# EAGLE design voltaged (EAGLE 9.6.0)
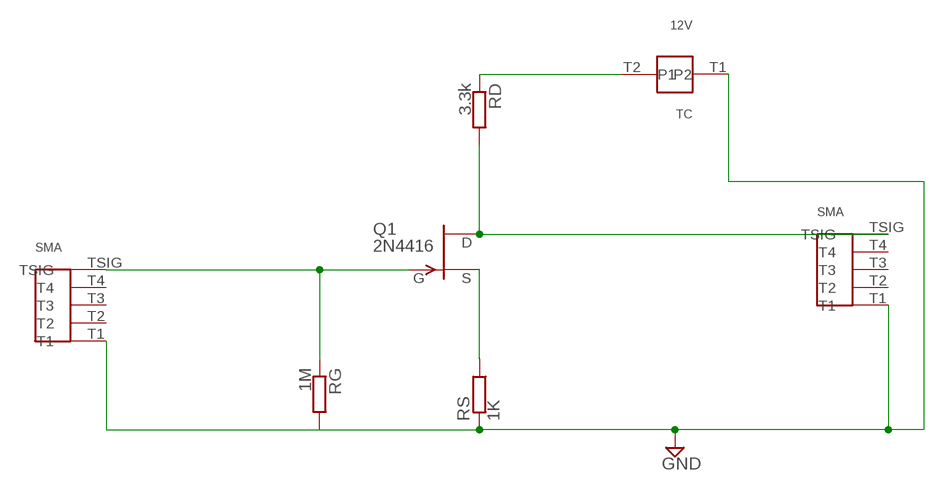
[diagram p0: schematic, sheet 1]

## Parts
Q1  2N4416  [TO72]
RD  3.3k  SMR-0  [SMR-0]
RG  1M  SMR-0  [SMR-0]
RS  1K  SMR-0  [SMR-0]
U$1  TC  [TC]
U$2  TC  [TC]
U$3  TC  [TC]

## Nets
GND: RG.1 RS.2 U$1.T1(P1) U$2.T1 U$3.T1
N$1: Q1.3(G) RG.2 U$2.TSIG
N$4: Q1.1(S) RS.1
N$6: Q1.2(D) RD.1 U$3.TSIG
N$7: RD.2 U$1.T2(P2)
Unconnected: U$2.T2 U$2.T3 U$2.T4 U$3.T2 U$3.T3 U$3.T4

## Library data of the parts
Q1 = transistor-fet:2N4416: N-Channel JFET Source: www.vishay.com
RD RG RS = resistor-shunt:SMR-0: SMD SHUNT RESISTOR; OC_FARNELL: unknown; OC_NEWARK: unknown
U$1 = project1:TC
U$2 U$3 = project2:TC

## Board
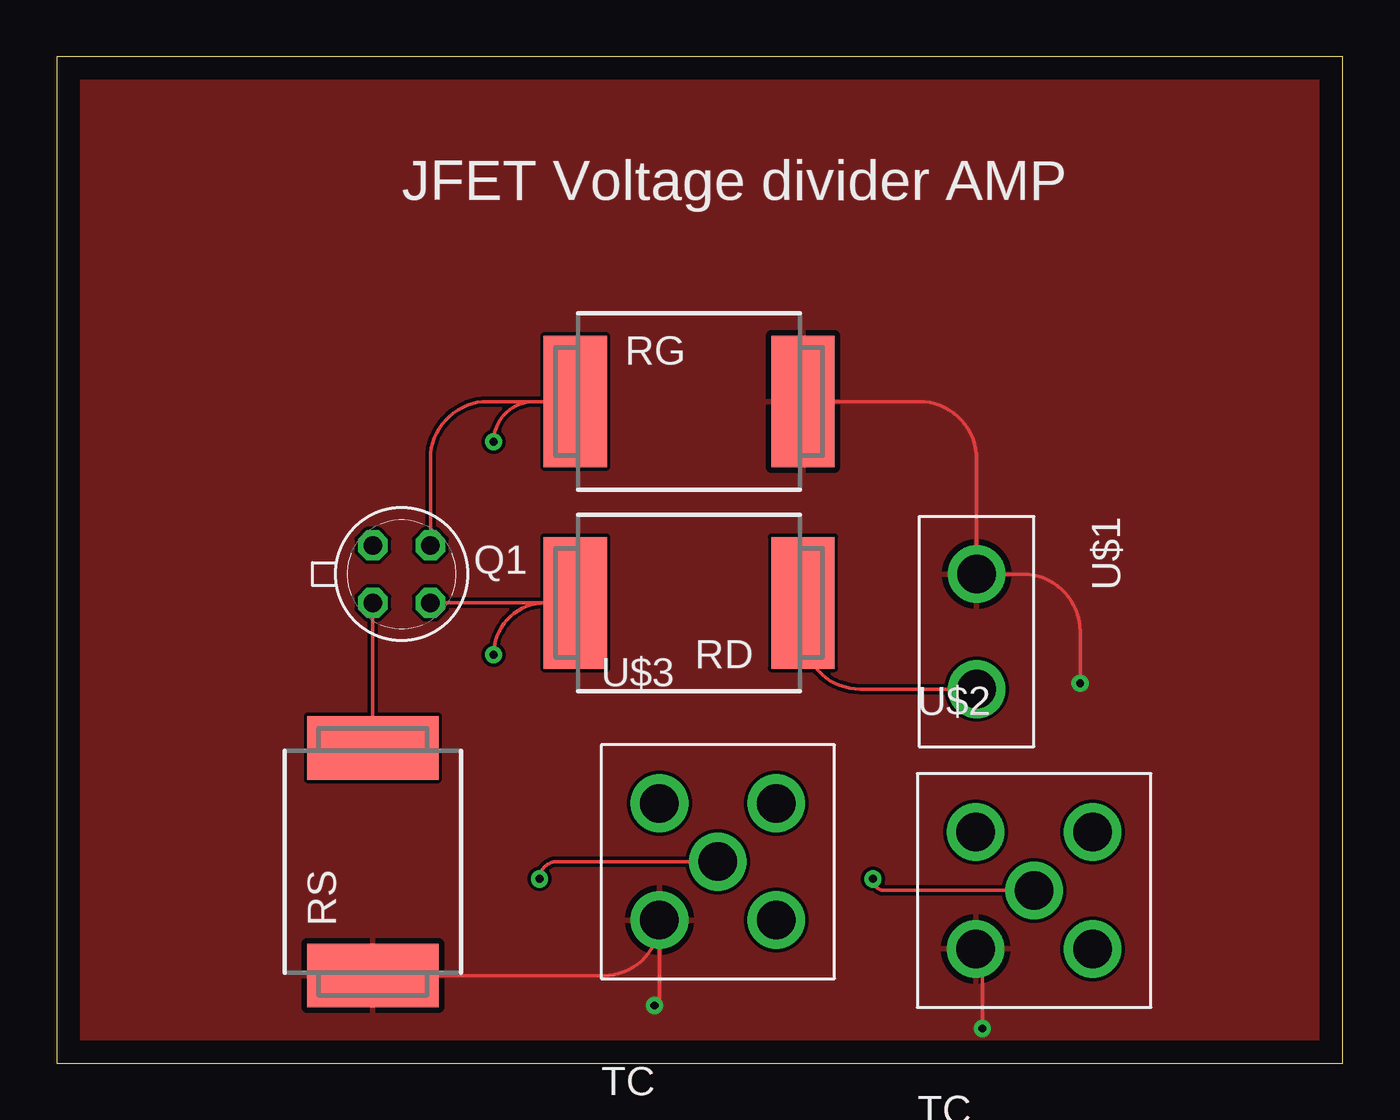
[diagram p1: board, top side]
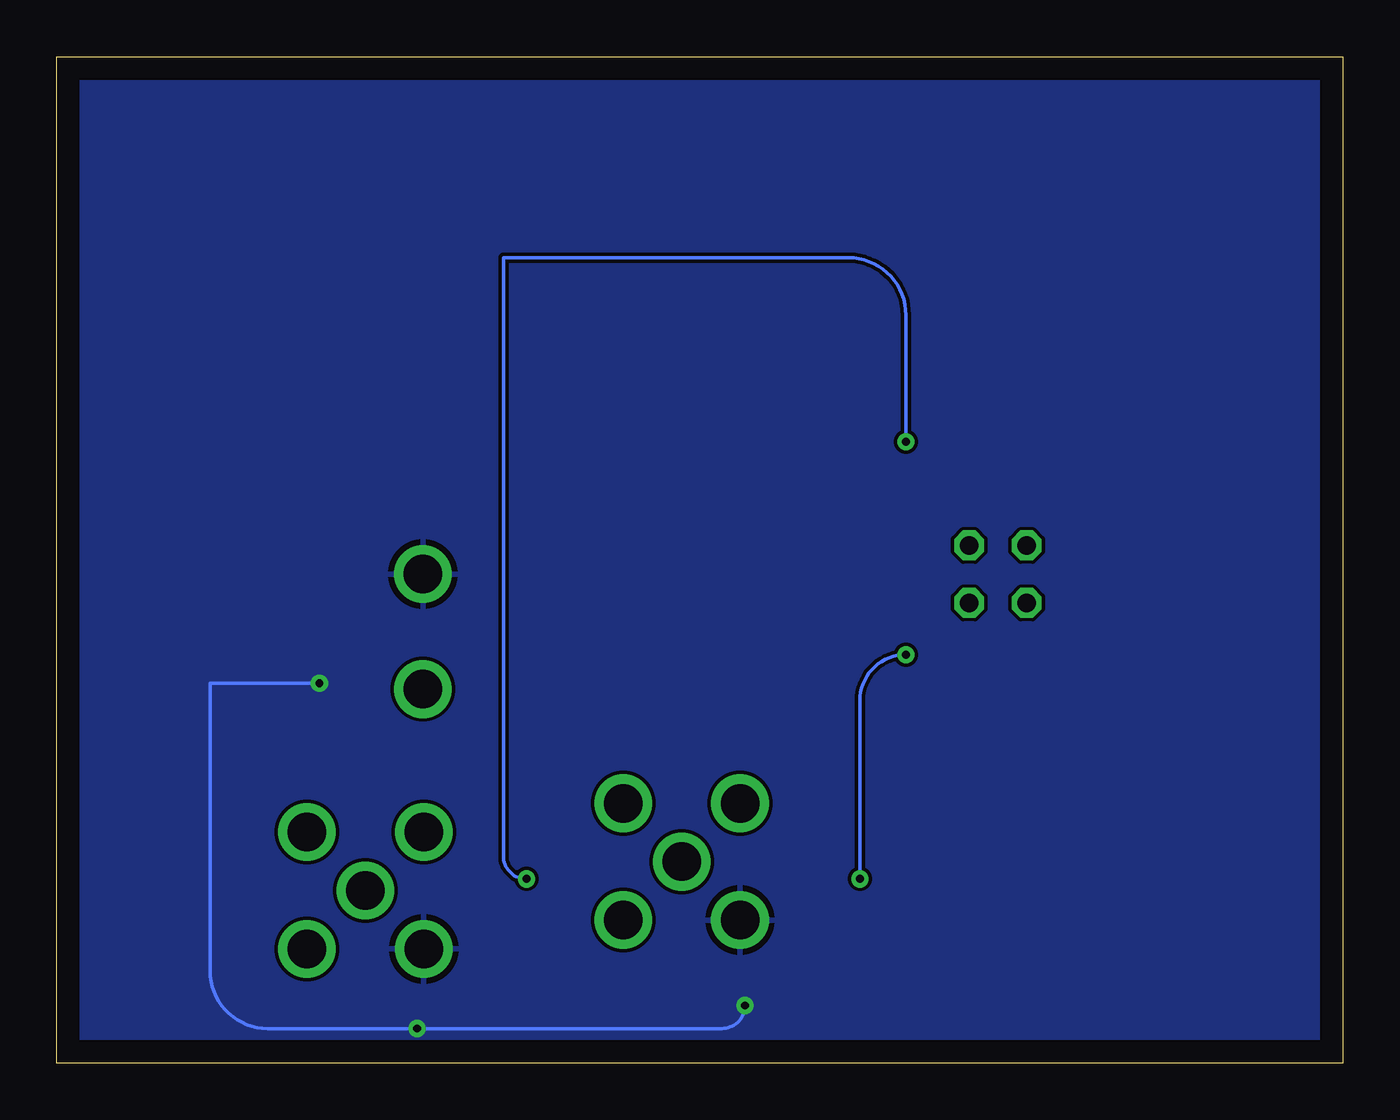
[diagram p2: board, bottom side, seen from below]

Size 56.82 x 44.44 mm. Coordinates in mm from the lower left corner, seen from the top.
Outline: 0,0 56.82,0 56.82,44.44 0,44.44 0,0
Copper layers (1*16): Top 0.035mm / dielectric 1.5mm / Bottom 0.035mm
Design rules "default": minimum track width 6mil, minimum drill 0.35mm, track to track 6mil, track to pad 6mil, pad to pad 6mil, via to via 6mil, smd to smd 6mil, copper to edge 40mil, drill to drill 6mil, minimum pad ring 10mil, minimum via ring 8mil, stop-mask expansion 4mil, vias tented up to drill 0mil, thermal gap 10mil

### Footprints (pad centres in the part's own frame; a part is rotated, then mirrored left to right if it is on the bottom)
TO72 = drill 0.813 octagon: 1 -1.27,-1.27; 2 1.27,-1.27; 3 1.27,1.27; 4 -1.27,1.27
SMR-0 = smd 2.8 x 5.8: 1 5.029,0; 2 -5.029,0
TC = drill 1.7: T1 -2.54,0; T2 2.54,0
TC' = drill 1.7: T1 -2.58,-2.58; T2 2.58,-2.58; T3 2.58,2.58; T4 -2.58,2.58; TSIG 0,0

### Placement (x,y rotation side)
Q1  15.24,21.59 0 top
RD  27.94,20.32 180 top
RG  27.94,29.21 0 top
RS  13.97,8.89 90 top
U$1  40.64,19.05 270 top
U$2  TC  [TC']  43.18,7.62 0 top
U$3  TC  [TC']  29.21,8.89 0 top

### Tracks (layer width: path | path; a pad name or v marks a point on that pad's centre or on a via)
GND  (via drill 0.35)
  Top 0.152: RG.1 38.1,29.21 arc-90 40.64,26.67 U$1.T1 42.67,21.59 arc-90 45.21,19.05 v45.21,16.76 | RS.2 24.18,3.86 arc90 U$3.T1 26.63,2.75 arc-90 v26.42,2.54 | U$2.T1 arc-90 40.89,4.75 v40.89,1.52
  Bottom 0.152: v26.42,2.54 arc90 27.43,1.52 v40.89,1.52 47.5,1.52 arc90 50.04,4.06 50.04,16.76 v45.21,16.76
  pour Top: 0,44.45 56.9,44.45 56.9,43.69 56.9,-0.25 56.64,-0.25 0,-0.25 0,0
  pour Bottom: 0,44.45 56.9,44.45 56.9,41.15 56.9,0 55.37,0 0,0
N$1  (via drill 0.35)
  Top 0.152: Q1.3 16.51,26.67 arc-90 19.05,29.21 RG.2 21.08,29.21 arc90 v19.3,27.43 | v36.07,8.13 arc90 36.58,7.62 U$2.TSIG
  Bottom 0.152: v19.3,27.43 19.3,33.02 arc-90 21.84,35.56 37.08,35.56 37.08,9.14 arc-90 v36.07,8.13
N$4
  Top 0.152: RS.1 Q1.1
N$6  (via drill 0.35)
  Top 0.152: Q1.2 21.59,20.32 | v21.34,8.13 arc-90 22.1,8.89 U$3.TSIG | v19.3,18.03 arc-90 21.59,20.32 | 21.59,20.32 RD.1
  Bottom 0.152: v19.3,18.03 arc-90 21.34,16 v21.34,8.13
N$7
  Top 0.152: U$1.T2 35.51,16.51 arc-90 32.97,19.05 RD.2

### Text on the board
tNames: JFET Voltage divider AMP